# Altium schematic sheet io_headers.SchDoc
size A4
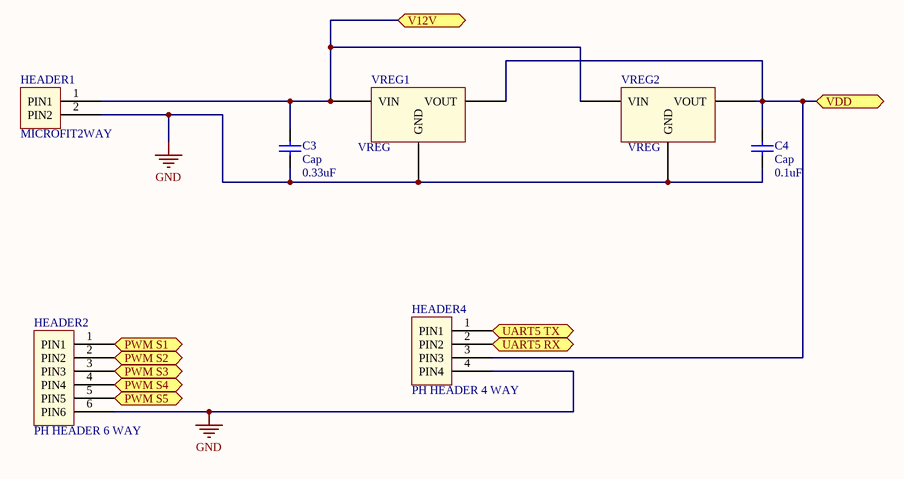
[diagram p0: io_headers.SchDoc]

## Parts
C3  Cap  value 0.33uF  [RAD-0.3]
C4  Cap  value 0.1uF  [RAD-0.3]
HEADER1  MICROFIT2WAY  [MICROFIT2WAY]
HEADER2  PH HEADER 6 WAY  [PH CONNECTOR 6 WAY]
HEADER4  PH HEADER 4 WAY  [PH_HEADER 4WAY]
VREG1  VREG  [TO-220 VREG]
VREG2  VREG  [TO-220 VREG]

## Ports
PWM S1, PWM S2, PWM S3, PWM S4, PWM S5, UART5 RX, UART5 TX, V12V, VDD

## Nets
GND: C3.1 C4.1 HEADER1.2(PIN2) HEADER2.6(PIN6) HEADER4.4(PIN4) VREG1.2(GND) VREG2.2(GND)
PWM S1: HEADER2.1(PIN1) ; port PWM S1
PWM S2: HEADER2.2(PIN2) ; port PWM S2
PWM S3: HEADER2.3(PIN3) ; port PWM S3
PWM S4: HEADER2.4(PIN4) ; port PWM S4
PWM S5: HEADER2.5(PIN5) ; port PWM S5
UART5 RX: HEADER4.2(PIN2) ; port UART5 RX
UART5 TX: HEADER4.1(PIN1) ; port UART5 TX
V12V: C3.2 HEADER1.1(PIN1) VREG1.1(VIN) VREG2.1(VIN) ; port V12V
VDD: C4.2 HEADER4.3(PIN3) VREG1.3(VOUT) VREG2.3(VOUT) ; port VDD

## Library data of the parts
C3 C4 = Cap: Capacitor; Published: 8-Jun-2000; LatestRevisionDate: 17-Jul-2002; LatestRevisionNote: Re-released for DXP Platform.; PackageReference: RAD-0.3; Publisher: Altium Limited; PackageDescription: Radial Cap, Thru-Hole; 2 Leads; 0.3 in Pin Spacing
HEADER1 = MICROFIT2WAY HEADER
VREG1 VREG2 = VOLTAGE REGULATOR